# Altium schematic sheet CAN.SchDoc: CAN
size A4; SheetNumber: 4; SheetSize: A4
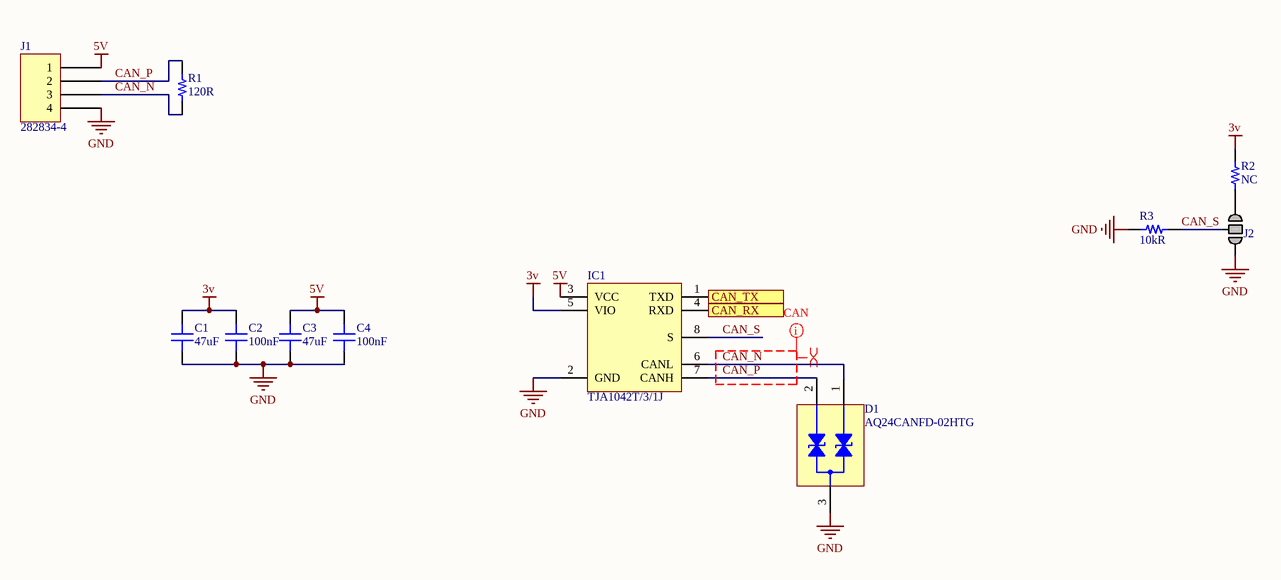
[diagram p0: CAN.SchDoc]

## Parts
C1  47uF  [CAP 0603/1608]
C2  100nF  [CAP 0603/1608]
C3  47uF  [CAP 0603/1608]
C4  100nF  [CAP 0603/1608]
D1  AQ24CANFD-02HTG  [ON SEMI SOT-23-3]
IC1  TJA1042T/3/1J  [NXP SOIC-8]
J1  282834-4  [TE 282834-4]  (no BOM)
J2  (no value)  [jump_3way]  (no BOM)
R1  120R  [RES 0603/1608]
R2  NC  [RES 0603/1608]  (no BOM)
R3  10kR  [RES 0603/1608]

## Ports
CAN_RX (out), CAN_TX (in)

## Nets
3v: C1.2 C2.2 IC1.5(VIO) R2.1
5V: C3.2 C4.2 IC1.3(VCC) J1.1
GND: C1.1 C2.1 C3.1 C4.1 D1.3(I/O_2) IC1.2(GND) J1.4 J2.3 R3.1
CAN_N: D1.1(I/O_1) IC1.6(CANL) J1.3 R1.1
CAN_P: D1.2(GND) IC1.7(CANH) J1.2 R1.2
CAN_RX: IC1.4(RXD) ; port CAN_RX
CAN_S: IC1.8(S) J2.2 R3.2
CAN_TX: IC1.1(TXD) ; port CAN_TX
NetJ2_1: J2.1 R2.2

## Layout directives
differential pair; differential pair class CAN: CAN_N, CAN_P
net class CAN: CAN_N, CAN_P

## Notes on the sheet
- Title:
- Size:
- Project:
- Revision:
- Sheet
- of
- Date:
- YıLDıZ IoT
- Elperek Mahallesi
- Saray Sokak, No:12
- SAKARYA / TURKEY
- File:

## Library data of the parts
C1 C3 = Capacitor - Ceramic: Ceramic, SMT Capacitor; Manufacturer: Murata; Manufacturer Part Number: GRM188C80E476ME05D; Voltage Rating: 2.5V; Dielectric: X6S; Tolerance: 20%; ComponentLink1URL: https://datasheet.ciiva.com/25713/cl10a475mq8nnnc-25713301.pdf?src-supplier=Digi-Key; ComponentLink1Description: https://datasheet.ciiva.com/25713/cl10a475mq8nnnc-25713301.pdf?src-supplier=Digi-Key; ComponentLink2URL: https://datasheet.ciiva.com/26838/getdatasheetpartid-358407-26838391.pdf?src-supplier=Verical; ComponentLink2Description: https://datasheet.ciiva.com/26838/getdatasheetpartid-358407-26838391.pdf?src-supplier=Verical; ComponentLink3URL: https://datasheet.ciiva.com/16437/cl05b104kq5nnnc-16437323.pdf?src-supplier=Future+Electronics; ComponentLink3Description: https://datasheet.ciiva.com/16437/cl05b104kq5nnnc-16437323.pdf?src-supplier=Future+Electronics; Supplier 1: Digi-Key; Supplier Part Number 1: 490-13244-1-ND; Stock 1: 56486; Pricing 1: 1 = 0,55000, 10 = 0,38500, 100 = 0,25380, 500 = 0,18800, 1000 = 0,15979 (USD); RoHS: Yes; Mount: Surface Mount; Case/Package: 0603; Case Code (Metric): 1608; Case Code (Imperial): 0603; Min Operating Temperature: -55°C; Max Operating Temperature: 105°C; Packaging: Tape and Reel; Capacitance: 47uF; Voltage Rating (DC): 2.5V; Length: 0.063inch; Width: 0.031inch; Thickness: 0.039inch; ComponentLink4URL: http://search.murata.co.jp/Ceramy/image/img/A01X/G101/ENG/GRM188C80E476ME05-01.pdf?src-supplier=Digi-Key; ComponentLink4Description: http://search.murata.co.jp/Ceramy/image/img/A01X/G101/ENG/GRM188C80E476ME05-01.pdf?src-supplier=Digi-Key; ComponentLink5URL: http://search.murata.co.jp/Ceramy/image/img/A01X/partnumbering_e_01.pdf?src-supplier=Digi-Key; ComponentLink5Description: http://search.murata.co.jp/Ceramy/image/img/A01X/partnumbering_e_01.pdf?src-supplier=Digi-Key
C2 C4 = Capacitor - Ceramic: Ceramic, SMT Capacitor; Manufacturer: KEMET; Manufacturer Part Number: C0603C104Z3VACTU; Tolerance: 80%; Voltage Rating: 25V; Dielectric: Y5V; Dissipation Factor: 7%; Supplier 1: Digi-Key; Supplier Part Number 1: 399-1100-1-ND; Stock 1: 1148385; Pricing 1: 1 = 0,10000, 10 = 0,03200, 100 = 0,01430, 500 = 0,01020, 1000 = 0,00802 (USD); RoHS: Yes; Mount: Surface Mount,PCB; Case/Package: 0603; Number of Pins: 2; Case Code (Metric): 1608; Case Code (Imperial): 0603; Dielectric Material: Ceramic; Min Operating Temperature: -30°C; Max Operating Temperature: 85°C; Capacitance: 100nF; Packaging: Tape and Reel; Voltage Rating (DC): 25V; Package Quantity: 1; Termination: SMD/SMT; Voltage: 25V; Length: 1.6mm; Height: 0.8mm; Width: 0.031inch; Thickness: 0.034inch; Lead Pitch: 0.7mm; Depth: 0.8mm; Radiation Hardening: No; REACH SVHC: No SVHC; Lead Free: Lead Free; ComponentLink1URL: https://datasheet.ciiva.com/46443/1828802-46443709.pdf?src-supplier=Element14; ComponentLink1Description: https://datasheet.ciiva.com/46443/1828802-46443709.pdf?src-supplier=Element14; ComponentLink2URL: https://datasheet.ciiva.com/14589/70095383-14589007.pdf?src-supplier=Allied+Electronics; ComponentLink2Description: https://datasheet.ciiva.com/14589/70095383-14589007.pdf?src-supplier=Allied+Electronics; ComponentLink3URL: https://datasheet.ciiva.com/7823/1470417-7823994.pdf?src-supplier=Element14; ComponentLink3Description: https://datasheet.ciiva.com/7823/1470417-7823994.pdf?src-supplier=Element14; ComponentLink4URL: https://datasheet.ciiva.com/46443/1828802-46443708.pdf?src-supplier=Element14; ComponentLink4Description: https://datasheet.ciiva.com/46443/1828802-46443708.pdf?src-supplier=Element14
D1 = NUP2105LT1G: TVS DIODE 24V 44V SOT23-3; Manufacturer: Littelfuse; ComponentLink1Description: Datasheet; ComponentLink1URL: http://www.onsemi.com/pub/Collateral/NUP2105L-D.PDF; ComponentLink2Description: DigiKey Link; ComponentLink2URL: http://digikey.com/product-detail/en/on-semiconductor/NUP2105LT1G/NUP2105LT1GOSCT-ND/1485001; Supplier 1: Digi-Key; Supplier Part Number 1: F10993CT-ND; Manufacturer Part Number: AQ24CANFD-02HTG; Stock 1: 2428; Pricing 1: 1 = 0,41000, 10 = 0,32900, 25 = 0,30120, 100 = 0,18900, 250 = 0,18692, 500 = 0,17500, 1000 = 0,11900 (USD); RoHS: No
IC1 = NXP TJA1042T_3_1J: High Speed CAN, CAN FD Transceiver; Manufacturer: NXP Semiconductors; Number of Transceivers: 1; Simplex/Duplex: Half Duplex; Receiver Hysteresis: 120mV; Max Supply Current: 70mA; Data Rate: 5Mbps; Min Supply Voltage: 4.5V; Max Supply Voltage: 5.5V; ComponentLink1URL: https://datasheet.ciiva.com/29898/tja1042-29898024.pdf?src-supplier=Avnet; ComponentLink1Description: https://datasheet.ciiva.com/29898/tja1042-29898024.pdf?src-supplier=Avnet; Supplier 1: Digi-Key; Supplier Part Number 1: 568-12625-1-ND; Manufacturer Part Number: TJA1042T/3/1J; Stock 1: 9244; Pricing 1: 1 = 1,24000, 10 = 1,11300, 25 = 1,05600, 100 = 0,81100, 250 = 0,71668, 500 = 0,67896, 1000 = 0,52808 (USD); RoHS: Yes; Mount: Surface Mount; Case/Package: SOIC; Number of Pins: 8; Contact Plating: Gold,Silver; Min Operating Temperature: -40°C; Max Operating Temperature: 150°C; Packaging: Tape and Reel; Radiation Hardening: No; REACH SVHC: No SVHC; Lead Free: Lead Free
J1 = 282834-4: TERM BLK 4P SIDE ENT 2.54MM PCB; Manufacturer: TE Connectivity AMP Connectors; Current: 10A; Mating Orientation: Horizontal with Board; Number of Levels: 1; Pitch: 0.100" (2.54mm); Positions Per Level: 4; Voltage: 150V; Wire Gauge: 16-30 AWG; Wire Termination: Screw - Rising Cage Clamp; Part Number: 282834-4; Color: Green; ComponentLink1Description: Datasheet; ComponentLink1URL: https://www.te.com/commerce/DocumentDelivery/DDEController?Action=srchrtrv&DocNm=282834&DocType=Customer+Drawing&DocLang=English; ComponentLink2Description: DigiKey Link; ComponentLink2URL: http://digikey.com/product-detail/en/te-connectivity-amp-connectors/282834-4/A98335-ND/1153265; LastUpdated: 15.01.2020 04:16:05; Lifecycle Status: Active; Minimum Order: 1; Mounting Type: Through Hole; Packaging: Bulk; Part Status: Active; Price: 2.68; Series: Buchanan; Supplier 1: DigiKey; Supplier Part Number 1: A98335-ND
J2 = JUMPER: Selectable jumber
R1 = Resistor_Chip: Ceramic, SMT Capacitor; Manufacturer: Susumu; Manufacturer Part Number: RR0816P-121-D; Power Rating: 63mW; Tolerance: 0.5%; Voltage Rating: 75V; Temperature Coefficient: 25ppm/°C; Supplier 1: Digi-Key; Supplier Part Number 1: RR08P120DCT-ND; Stock 1: 6882; Pricing 1: 1 = 0,11000, 10 = 0,09800, 100 = 0,03760, 1000 = 0,01654, 2500 = 0,01428 (USD); RoHS: Yes; Case/Package: 0603; Number of Pins: 2; Case Code (Metric): 1608; Case Code (Imperial): 0603; Min Operating Temperature: -55°C; Max Operating Temperature: 125°C; Package Quantity: 1; Resistance: 120R; Packaging: Tape and Reel; Composition: Thin Film; Number of Terminations: 2; Termination: SMD/SMT; Max Power Dissipation: 63mW; Voltage Rating (DC): 75V; Length: 0.063inch; Height: 0.02inch; Width: 0.032inch; Depth: 0.8mm; Height - Seated (Max): 0.02inch; REACH SVHC: Unknown; Lead Free: Lead Free; ComponentLink1URL: http://www.susumu.co.jp/common/pdf/n_catalog_partition05_en.pdf; ComponentLink1Description: http://www.susumu.co.jp/common/pdf/n_catalog_partition05_en.pdf; ComponentLink2URL: http://documents.rs-components.com/techlib://itc_doclist_GB.htm?stockno=4744287; ComponentLink2Description: http://documents.rs-components.com/techlib://itc_doclist_GB.htm?stockno=4744287
R2 = Resistor_Chip: Ceramic, SMT Capacitor; Resistance: NC
R3 = Resistor_Chip: Ceramic, SMT Capacitor; Manufacturer: Stackpole Electronics; Manufacturer Part Number: RNCP0603FTD10K0; Tolerance: 1%; Max Power Dissipation: 125mW; Temperature Coefficient: 100ppm/°C; Supplier 1: Digi-Key; Supplier Part Number 1: RNCP0603FTD10K0CT-ND; Stock 1: 183083; Pricing 1: 1 = 0,10000, 10 = 0,06700, 100 = 0,02730, 1000 = 0,01224, 2500 = 0,01063 (USD); RoHS: Yes; Mount: Surface Mount; Case/Package: 0603; Case Code (Metric): 1608; Case Code (Imperial): 0603; Contact Plating: Matte,Tin; Min Operating Temperature: -55°C; Max Operating Temperature: 155°C; Packaging: Tape and Reel; Resistance: 10kR; Composition: Thin Film; Number of Terminations: 2; Features: Anti-Sulfur,Moisture Resistant; Length: 0.059inch; Height: 0.02inch; Width: 0.031inch; Radiation Hardening: No; Lead Free: Lead Free